# EAGLE design main (EAGLE 9.0.1)
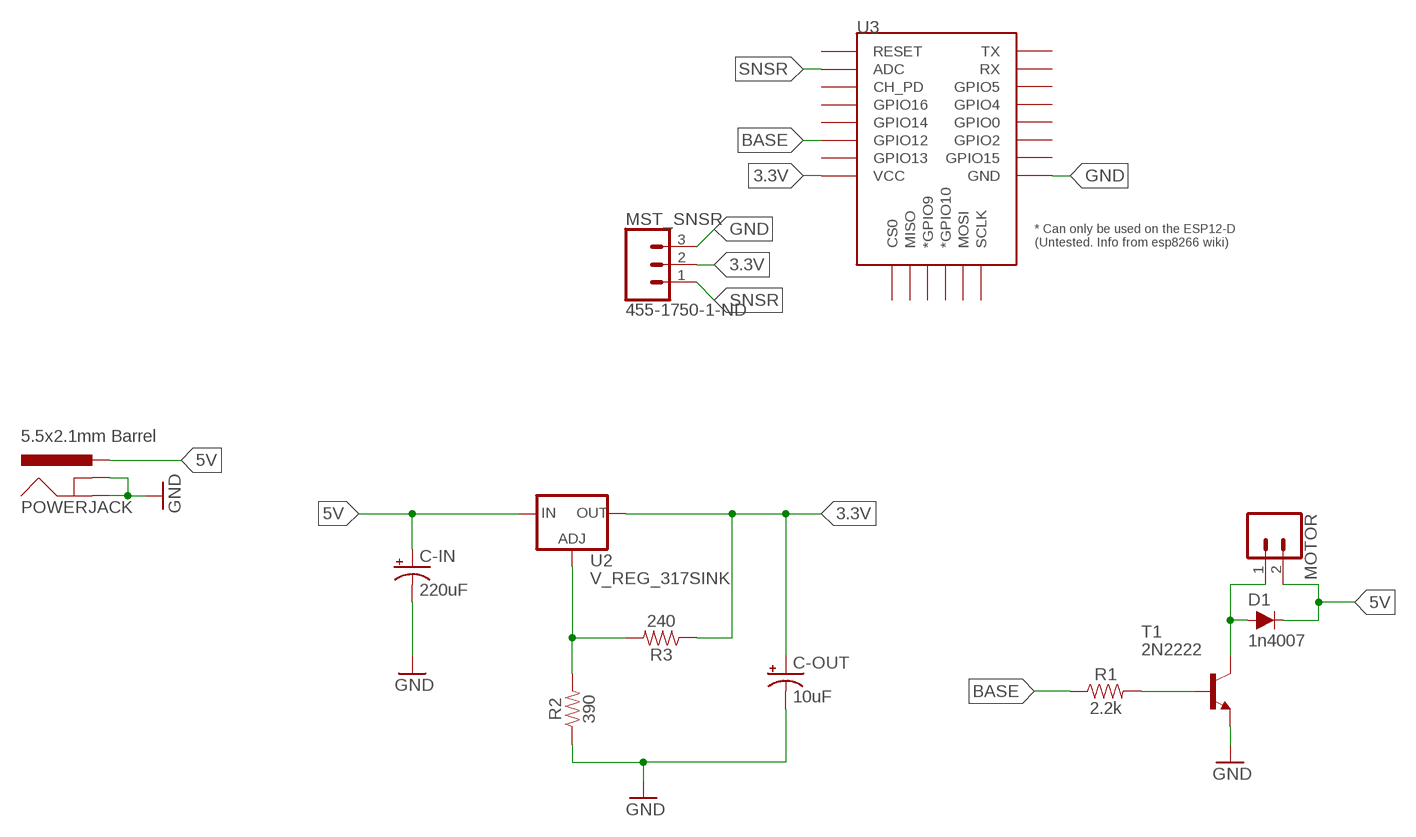
[diagram p0: schematic, sheet 1]

## Parts
C-IN  220uF  10UF-POLAR-RADIAL-2.5MM-25V-20%  [CPOL-RADIAL-2.5MM-5MM]
C-OUT  10uF  10UF-POLAR-RADIAL-2.5MM-25V-20%  [CPOL-RADIAL-2.5MM-5MM]
D1  1n4007  DIODE-1N4148  [DIODE-1N4148]
MOTOR  CONN_02  [1X02]
MST_SNSR  455-1750-1-ND  CONN_03  [1X03]
POWERJACK  5.5x2.1mm Barrel  POWER_JACKSMD  [POWER_JACK_SMD]
R1  2.2k  0.3OHM-0805-1/8W-1%  [0805]
R2  390  0.3OHM-0805-1/8W-1%  [0805]
R3  240  0.3OHM-0805-1/8W-1%  [0805]
T1  2N2222  [TO92-EBC-OVAL]
U2  V_REG_317SINK  [TO220-ADJ]
U3  ESP12ESMD  [ESP12E-SMD]

## Nets
3.3V: C-OUT.1(+) MST_SNSR.2 R3.1 U2.OUT U3.VCC
5V: C-IN.1(+) D1.C MOTOR.2 POWERJACK.VIN0(PWR) U2.IN
BASE: R1.1 U3.GPIO12
GND: C-IN.2(-) C-OUT.2(-) MST_SNSR.3 POWERJACK.GND(GNDBREAK) POWERJACK.P$4(GND) R2.1 T1.E U3.GND
N$3: R2.2 R3.2 U2.ADJ
N$5: R1.2 T1.B
N$6: D1.A MOTOR.1 T1.C
SNSR: MST_SNSR.1 U3.ADC
Unconnected: U3.CH_PD U3.CS0 U3.GPIO0 U3.GPIO2 U3.GPIO4 U3.GPIO5 U3.GPIO9(*GPIO9) U3.GPIO10(*GPIO10) U3.GPIO13 U3.GPIO14 U3.GPIO15 U3.GPIO16 U3.MISO U3.MOSI U3.RESET U3.RXD0(RX) U3.SCLK U3.TXD0(TX)

## Library data of the parts
C-IN = SparkFun-Capacitors:10UF-POLAR: 10.0µF polarized capacitors A capacitor is a passive two-terminal electrical component used to store electrical energy temporarily in an electric field.; PROD_ID: CAP-08440; VALUE: 10uF
C-OUT = SparkFun-Capacitors:10UF-POLAR: 10.0µF polarized capacitors A capacitor is a passive two-terminal electrical component used to store electrical energy temporarily in an electric field.; PROD_ID: CAP-08440
D1 = SparkFun-DiscreteSemi:DIODE: Diode These are standard reverse protection diodes and small signal diodes. SparkFun Products: SparkFun SparkPunk Sound Kit <https://www.sparkfun.com/products/11177> SparkFun ESP8266 Thing <https://www.sparkfun.com/products/13231>; PROD_ID: DIO-08378; VALUE: 200mA/100V/1V
MOTOR = SparkFun-Connectors:CONN_02: Multi connection point. Often used as Generic Header-pin footprint for 0.1 inch spaced/style header connections On any of the 0.1 inch spaced packages, you can populate with these: Break Away Headers - Straight <https://www.sparkfun.com/products/116> (PRT-00116) Break Away Male Headers - Right Angle <https://www.sparkfun.com/products/553> (PRT-00553) Female Headers <https://www.sparkfun.com/products/115> (PRT-00115) Break Away Headers - Machine Pin <https://www.sparkfun.com/products/117> (PRT-00117) Break Away Female Headers - Swiss Machine Pin <https://www.sparkfun.com/products/743> (PRT-00743) For SCREWTERMINALS and SPRING TERMINALS visit here: Screw Terimnals on SparkFun.com <https://www.sparkfun.com/search/results?term=Screw+Terminals> (5mm/3.5mm/2.54mm spacing) This device is also useful as a general connection point to wire up your design to another part of your project. Our various solder wires solder well into these plated through hole pads. Hook-Up Wire - Assortment (Stranded, 22 AWG) <https://www.sparkfun.com/products/11375> (PRT-11375) Hook-Up Wire - Assortment (Solid Core, 22 AWG) <https://www.sparkfun.com/products/11367> (PRT-11367) View the entire wire category on our website here <https://www.sparkfun.com/categories/141> Special notes: Molex polarized connector foot print use with: PRT-08233 with associated crimp pins and housings. 2.54_SCREWTERM for use with PRT-10571. 3.5mm Screw Terminal footprints for PRT-08084 5mm Screw Terminal footprints for use with PRT-08432
MST_SNSR = SparkFun-Connectors:CONN_03: Multi connection point. Often used as Generic Header-pin footprint for 0.1 inch spaced/style header connections On any of the 0.1 inch spaced packages, you can populate with these: Break Away Headers - Straight <https://www.sparkfun.com/products/116> (PRT-00116) Break Away Male Headers - Right Angle <https://www.sparkfun.com/products/553> (PRT-00553) Female Headers <https://www.sparkfun.com/products/115> (PRT-00115) Break Away Headers - Machine Pin <https://www.sparkfun.com/products/117> (PRT-00117) Break Away Female Headers - Swiss Machine Pin <https://www.sparkfun.com/products/743> (PRT-00743) Stackable Header - 3 Pin (Female, 0.1") <https://www.sparkfun.com/products/13875> (PRT-13875) For SCREWTERMINALS and SPRING TERMINALS visit here: Screw Terimnals on SparkFun.com <https://www.sparkfun.com/search/results?term=Screw+Terminals> (5mm/3.5mm/2.54mm spacing) This device is also useful as a general connection point to wire up your design to another part of your project. Our various solder wires solder well into these plated through hole pads. Hook-Up Wire - Assortment (Stranded, 22 AWG) <https://www.sparkfun.com/products/11375> (PRT-11375) Hook-Up Wire - Assortment (Solid Core, 22 AWG) <https://www.sparkfun.com/products/11367> (PRT-11367) View the entire wire category on our website here <https://www.sparkfun.com/categories/141> Special notes: Molex polarized connector foot print use with SKU : PRT-08232 with associated crimp pins and housings.; PROD_ID: XXX-00000
POWERJACK = SparkFun-Connectors:POWER_JACK: Power Jack Connector This is the standard 5.5mm barrel jack for power. The PTH is the most common, proven, reliable, footprint. The Slot footprint only works if the mill layer is transmitted to the PCB fab house so be warned. Here are the connectors we sell at SparkFun: DC Barrel Power Jack/Connector <https://www.sparkfun.com/products/119> (PRT-00119) DC Barrel Power Jack/Connector (SMD) <https://www.sparkfun.com/products/12748> (PRT-12748) DC Barrel Jack Adapter - Breadboard Compatible <https://www.sparkfun.com/products/10811> (PRT-10811) It is used on this SparkFun product (and many, many others): SparkFun RedBoard - Programmed with Arduino <https://www.sparkfun.com/products/12757> (DEV-12757) Also, if you need a mating power supply or connector, please check these out: Wall Adapter Power Supply - 9VDC 650mA <https://www.sparkfun.com/products/298> (TOL-00298) DC Barrel Jack Adapter - Male <https://www.sparkfun.com/products/10287> (PRT-10287); PROD_ID: CONN-08106; SF_ID: PRT-12748
R1-R3 = SparkFun-Resistors:0.3OHM: 0.3Ω resistor A resistor is a passive two-terminal electrical component that implements electrical resistance as a circuit element. Resistors act to reduce current flow, and, at the same time, act to lower voltage levels within circuits. - Wikipedia; PROD_ID: RES-11622; VALUE: 0.3
T1 = adafruit:2N2222: NPN TRANSISTOR Big oval pads
U2 = SparkFun-IC-Power:V_REG_317: Voltage Regulator Standard LM317 adjustable voltage regulator. AOI (Adjust Output Input). Google 'LM317 Calculator' for easy to use app to get the two resistor values needed. 240/720 for 5V output. 240/390 for 3.3V output. Spark Fun Electronics SKU : COM-00527
U3 = esp8266modules:ESP12E: ESP12E Module

## Board
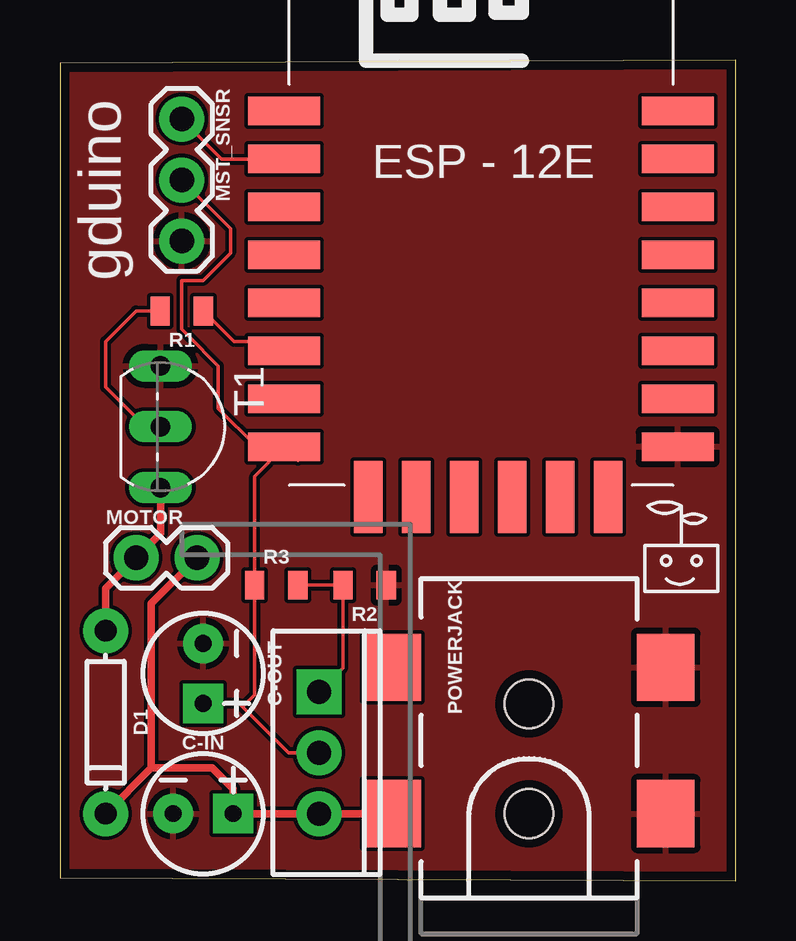
[diagram p1: board, top side]

Size 28.17 x 34.21 mm. Coordinates in mm from the lower left corner, seen from the top.
Outline: 0,0.13 28.17,0 28.17,34.21 0,34.09 0,0.13
Copper layers (1*16): Top 0.035mm / dielectric 1.5mm / Bottom 0.035mm
Design rules "OSHPark": minimum track width 6mil, minimum drill 0.35mm, track to track 6mil, track to pad 6mil, pad to pad 6mil, via to via 6mil, smd to smd 6mil, copper to edge 15mil, drill to drill 10mil, minimum pad ring 10mil, minimum via ring 8mil, stop-mask expansion 4mil, vias tented up to drill 0mil, thermal gap 10mil

### Footprints (pad centres in the part's own frame; a part is rotated, then mirrored left to right if it is on the bottom)
CPOL-RADIAL-2.5MM-5MM = drill 0.7 pad 1.651 square: 1 1.25,0 | drill 0.7 pad 1.651: 2 -1.25,0
DIODE-1N4148 = drill 0.9 pad 1.88: A -3.81,0; C 3.81,0
1X02 = drill 1.016 pad 1.88: 1 0,0; 2 2.54,0
1X03 = drill 1.016 pad 1.88: 1 0,0; 2 2.54,0; 3 5.08,0
POWER_JACK_SMD = smd 2.8 x 2.4: GND 0,-5.7; P$4 6.1,-5.7; VIN0 0,5.7; VIN1 6.1,5.7 | hole 2.032: 0,0; 4.572,0
0805 = smd 0.8 x 1.2: 1 -0.9,0; 2 0.9,0
TO92-EBC-OVAL = drill 0.813 long: B 0,-1.27; C 2.54,-1.27; E -2.54,-1.27
TO220-ADJ = drill 1 pad 1.88 square: ADJ -2.54,0 | drill 1 pad 1.88: IN 2.54,0; OUT 0,0
ESP12E-SMD = smd 3 x 1.2: ADC -8.3,3.8; CH_PD -8.3,1.8; GND 8.1,-8.2; GPIO0 8.1,-2.2; GPIO2 8.1,-4.2; GPIO4 8.1,-0.2; GPIO5 8.1,1.8; GPIO12 -8.3,-4.2; GPIO13 -8.3,-6.2; GPIO14 -8.3,-2.2; GPIO15 8.1,-6.2; GPIO16 -8.3,-0.2; RESET -8.3,5.8; RXD0 8.1,3.8; TXD0 8.1,5.8; VCC -8.3,-8.2 | smd 1.2 x 3: CS0 -4.8,-10.3; GPIO9 -0.8,-10.3; GPIO10 1.2,-10.3; MISO -2.8,-10.3; MOSI 3.2,-10.3; SCLK 5.2,-10.3

### Placement (x,y rotation side)
C-IN  5.97,2.79 0 top
C-OUT  5.97,8.64 270 top
D1  1.91,6.6 270 top
MOTOR  3.18,13.46 0 top
MST_SNSR  5.08,31.75 270 top
POWERJACK  19.56,2.79 90 top
R1  5.08,23.75 180 top
R2  12.7,12.32 180 top
R3  9.02,12.32 0 top
T1  5.46,18.92 270 top
U2  10.8,5.33 270 top
U3  17.65,26.29 0 top

### Tracks (layer width: path | path; a pad name or v marks a point on that pad's centre or on a via)
3.3V
  Top 0.152: U3.VCC 9.92,17.53 | U3.VCC 8.12,16.85 R3.1 8.12,7.74 7.62,7.24 | U2.OUT 9.53,5.33 7.62,7.24 | C-OUT.1 7.47,7.39 7.62,7.24 | U3.VCC 8.2,18.09 6.6,19.69 6.6,21.46 5.33,22.73 5.08,22.99 5.08,25.02 5.97,25.02 7.11,26.16 7.11,27.18 MST_SNSR.2
5V
  Top 0.305: POWERJACK.VIN0 U2.IN C-IN.1 7.22,3.83 6.35,4.7 3.81,4.7 | 3.81,4.7 D1.C | 3.81,4.7 3.81,11.56 MOTOR.2
BASE
  Top 0.152: U3.GPIO12 8.96,22.48 7.25,22.48 R1.1
GND
  pour Top: -17.78,59.31 -17.78,-16.89 85.09,-16.89 86.36,-15.62 86.36,59.31
N$3
  Top 0.152: U2.ADJ 11.8,8.88 R2.2 R3.2
N$5
  Top 0.152: T1.B 3.56,18.92 1.91,20.57 1.91,22.48 3.18,23.75 R1.2
N$6
  Top 0.305: D1.A 1.91,12.19 MOTOR.1 4.19,14.48 T1.C
SNSR
  Top 0.152: MST_SNSR.1 6.74,30.09 U3.ADC

### Text on the board
tNames: gduino